# EAGLE design Proximity_sensor_v1 (EAGLE 9.2.0)
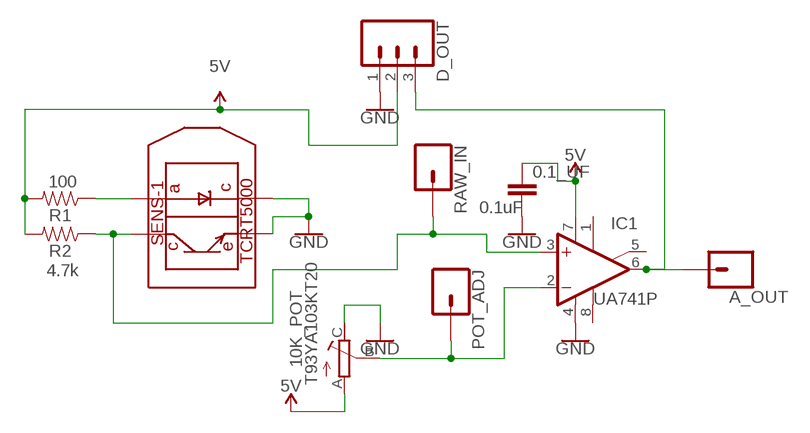
[diagram p0: schematic, sheet 1]

## Parts
0.1_UF  0.1uF  0.1UF-KIT-EZ-50V-20%  [CAP-PTH-SMALL-KIT]
10K_POT  T93YA103KT20  [TRIM_T93YA103KT20]
A_OUT  CONN_01  [1X01]
D_OUT  CONN_03  [1X03]
IC1  UA741P  [DIL08]
POT_ADJ  CONN_01  [1X01]
R1  100  RESISTORAXIAL-0.3-KIT  [AXIAL-0.3-KIT]
R2  4.7k  RESISTORAXIAL-0.3-KIT  [AXIAL-0.3-KIT]
RAW_IN  CONN_01  [1X01]
SENS-1  TCRT5000  [5000]

## Nets
5V: 0.1_UF.1 10K_POT.A D_OUT.2 IC1.7(V+) R1.P$2 R2.P$2
GND: 0.1_UF.2 10K_POT.C D_OUT.1 IC1.4(V-) SENS-1.P$2 SENS-1.P$4
N$1: R1.P$1 SENS-1.P$3
N$3: 10K_POT.B IC1.2(-IN) POT_ADJ.1
N$4: A_OUT.1 D_OUT.3 IC1.6(OUT)
N$5: IC1.3(+IN) R2.P$1 RAW_IN.1 SENS-1.P$1
Unconnected: IC1.1(ON1) IC1.5(ON2) IC1.8(OPT)

## Library data of the parts
0.1_UF = SparkFun-Capacitors:0.1UF: 0.1µF ceramic capacitors A capacitor is a passive two-terminal electrical component used to store electrical energy temporarily in an electric field.; PROD_ID: CAP-08370
10K_POT = Pot-Multi-turn:T93YA103KT20: Res Cermet Trimmer 10K Ohm 10% 1/2W 21(Elec)/23(Mech)Turn 2.2mm (9.7 X 5 X 11.1mm) Pin Thru-Hole Tube; DESCRIPTION: Res Cermet Trimmer 10K Ohm 10% 1/2W 21_Elec_/23_Mech_Turn 2.2mm _9.7 X 5 X 11.1mm_ Pin Thru-Hole Tube; DIGI-KEY_PART_NUMBER: T93YA-10K-ND; DIGI-KEY_PURCHASE_URL: https://www.digikey.com/product-detail/en/vishay-sfernice/T93YA103KT20/T93YA-10K-ND/1587711?utm_source=snapeda&utm_medium=aggregator&utm_campaign=symbol; MF: Vishay; MP: T93YA103KT20; PACKAGE: TSOP-34338 Vishay
A_OUT POT_ADJ RAW_IN = SparkFun-Connectors:CONN_01: Single connection point. Often used as Generic Header-pin footprint for 0.1 inch spaced/style header connections On any of the 0.1 inch spaced packages, you can populate with these: Break Away Headers - Straight <https://www.sparkfun.com/products/116> (PRT-00116) Break Away Male Headers - Right Angle <https://www.sparkfun.com/products/553> (PRT-00553) Female Headers <https://www.sparkfun.com/products/115> (PRT-00115) Break Away Headers - Machine Pin <https://www.sparkfun.com/products/117> (PRT-00117) Break Away Female Headers - Swiss Machine Pin <https://www.sparkfun.com/products/743> (PRT-00743) This device is also useful as a general connection point to wire up your design to another part of your project. Our various solder wires solder well into these plated through hole pads. Hook-Up Wire - Assortment (Stranded, 22 AWG) <https://www.sparkfun.com/products/11375> (PRT-11375) Hook-Up Wire - Assortment (Solid Core, 22 AWG) <https://www.sparkfun.com/products/11367> (PRT-11367) View the entire wire category on our website here <https://www.sparkfun.com/categories/141> Special notes: SMTSO-256-ET is a "flush mount" nut for a 4-40 screw. We mostly use this on specialty testbeds; it is a nice way to connect hardware to your PCB at an adjustable hieght. Also note, the SNAP packages are for using a snappable style connector. We sell a baggie of snaps and they are also used on two LilyPad designs: Snap Assortment - 30 pack (male and female) <https://www.sparkfun.com/products/11347> (DEV-11347) LilyPad Arduino SimpleSnap <https://www.sparkfun.com/products/10941> (DEV-10941) LilyPad SimpleSnap Protoboard <https://www.sparkfun.com/products/10940> (DEV-10940)
D_OUT = SparkFun-Connectors:CONN_03: Multi connection point. Often used as Generic Header-pin footprint for 0.1 inch spaced/style header connections On any of the 0.1 inch spaced packages, you can populate with these: Break Away Headers - Straight <https://www.sparkfun.com/products/116> (PRT-00116) Break Away Male Headers - Right Angle <https://www.sparkfun.com/products/553> (PRT-00553) Female Headers <https://www.sparkfun.com/products/115> (PRT-00115) Break Away Headers - Machine Pin <https://www.sparkfun.com/products/117> (PRT-00117) Break Away Female Headers - Swiss Machine Pin <https://www.sparkfun.com/products/743> (PRT-00743) Stackable Header - 3 Pin (Female, 0.1") <https://www.sparkfun.com/products/13875> (PRT-13875) For SCREWTERMINALS and SPRING TERMINALS visit here: Screw Terimnals on SparkFun.com <https://www.sparkfun.com/search/results?term=Screw+Terminals> (5mm/3.5mm/2.54mm spacing) This device is also useful as a general connection point to wire up your design to another part of your project. Our various solder wires solder well into these plated through hole pads. Hook-Up Wire - Assortment (Stranded, 22 AWG) <https://www.sparkfun.com/products/11375> (PRT-11375) Hook-Up Wire - Assortment (Solid Core, 22 AWG) <https://www.sparkfun.com/products/11367> (PRT-11367) View the entire wire category on our website here <https://www.sparkfun.com/categories/141> Special notes: Molex polarized connector foot print use with SKU : PRT-08232 with associated crimp pins and housings.
IC1 = linear:*741: OP AMP
R1 R2 = SparkFun-Resistors:RESISTOR: Generic Resistor Package
SENS-1 = tcrt5000:TCRT5000: Reflective Optical Sensor with Transistor Output. Vishay Semiconductors

## Board
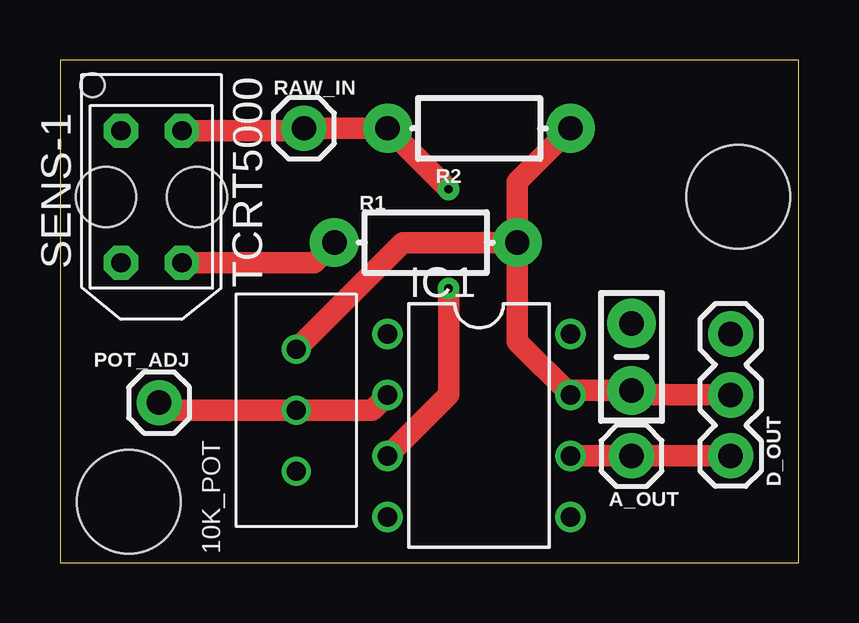
[diagram p1: board, top side]
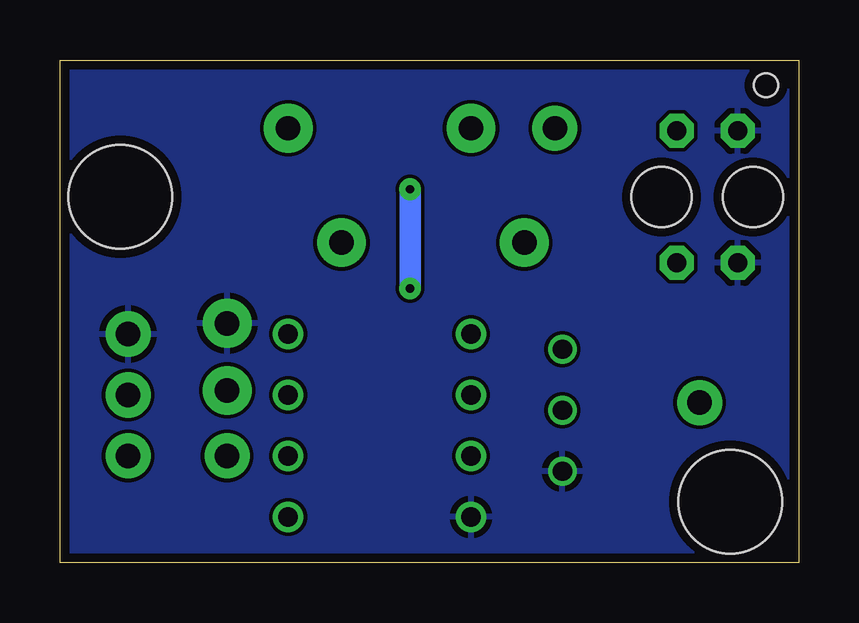
[diagram p2: board, bottom side, seen from below]

Size 30.78 x 20.94 mm. Coordinates in mm from the lower left corner, seen from the top.
Outline: 0,0 30.78,0 30.78,20.94 0,20.94 0,0
Copper layers (1*16): Top 0.035559375mm / dielectric 1.6mm / Bottom 0.035559375mm
Design rules "oshpark-2layer *": minimum track width 6mil, minimum drill 10mil, track to track 6mil, track to pad 6mil, pad to pad 6mil, via to via 6mil, smd to smd 6mil, copper to edge 15mil, drill to drill 6mil, minimum pad ring 5mil, minimum via ring 5mil, stop-mask expansion 2.5mil, vias tented up to drill 0mil, thermal gap 10mil
Holes 4.32 mm at 2.86,2.54 28.26,15.24

### Footprints (pad centres in the part's own frame; a part is rotated, then mirrored left to right if it is on the bottom)
CAP-PTH-SMALL-KIT = drill 1.016 pad 2.032: 1 -1.397,0; 2 1.397,0
TRIM_T93YA103KT20 = drill 0.8: A 0,2.54; B 0,0; C 0,-2.54
1X01 = drill 1.016 pad 1.88: 1 0,0
1X03 = drill 1.016 pad 1.88: 1 0,0; 2 2.54,0; 3 5.08,0
DIL08 = drill 0.813 pad 1.27: 1 -3.81,-3.81; 2 -1.27,-3.81; 3 1.27,-3.81; 4 3.81,-3.81; 5 3.81,3.81; 6 1.27,3.81; 7 -1.27,3.81; 8 -3.81,3.81
AXIAL-0.3-KIT = drill 1.016 pad 2.032: P$1 -3.81,0; P$2 3.81,0
5000 = drill 0.8 pad 1.422 octagon: P$1 -2.75,1.27; P$2 -2.75,-1.27; P$3 2.75,1.27; P$4 2.75,-1.27 | hole 2.5: 0,1.9; 0,-1.9 | hole 1: -4.65,-2.45

### Placement (x,y rotation side)
0.1_UF  23.81,8.57 90 top
10K_POT  9.84,6.35 0 top
A_OUT  23.81,4.45 0 top
D_OUT  27.94,9.53 270 top
IC1  17.46,5.71 270 top
POT_ADJ  4.13,6.67 0 top
R1  15.24,13.34 0 top
R2  17.46,18.1 0 top
RAW_IN  10.16,18.1 0 top
SENS-1  3.81,15.24 270 top

### Tracks (layer width: path | path; a pad name or v marks a point on that pad's centre or on a via)
5V
  Top 0.889: D_OUT.2 24,6.99 0.1_UF.1 21.46,7.18 IC1.7 19.05,9.21 R1.P$2 | R1.P$2 19.05,15.88 R2.P$2 | 10K_POT.A 14.29,13.34 R1.P$2
GND
  pour Bottom: 0,20.95 30.8,20.95 30.8,0 0,0
N$1
  Top 0.889: SENS-1.P$3 10.58,12.49 R1.P$1
N$3
  Top 0.889: POT_ADJ.1 4.45,6.35 10K_POT.B 13.02,6.35 IC1.2
N$4
  Top 0.889: IC1.6 A_OUT.1 D_OUT.3
N$5  (via drill 0.35 pad 0.9)
  Top 0.889: SENS-1.P$1 10.05,17.99 RAW_IN.1 R2.P$1 v16.19,15.56 | IC1.3 16.19,6.99 v16.19,11.43
  Bottom 0.889: v16.19,15.56 v16.19,11.43